# Altium schematic sheet 04_USB_diag.SchDoc: USB diagram
size A4; Organization: Lime Microsystems; Address1: Surrey Tech Centre; Address2: Guildford GU2 7YG; Address3: Surrey; Address4: United Kingdom; Revision: v1.3; SheetNumber: 4; SheetTotal: 13
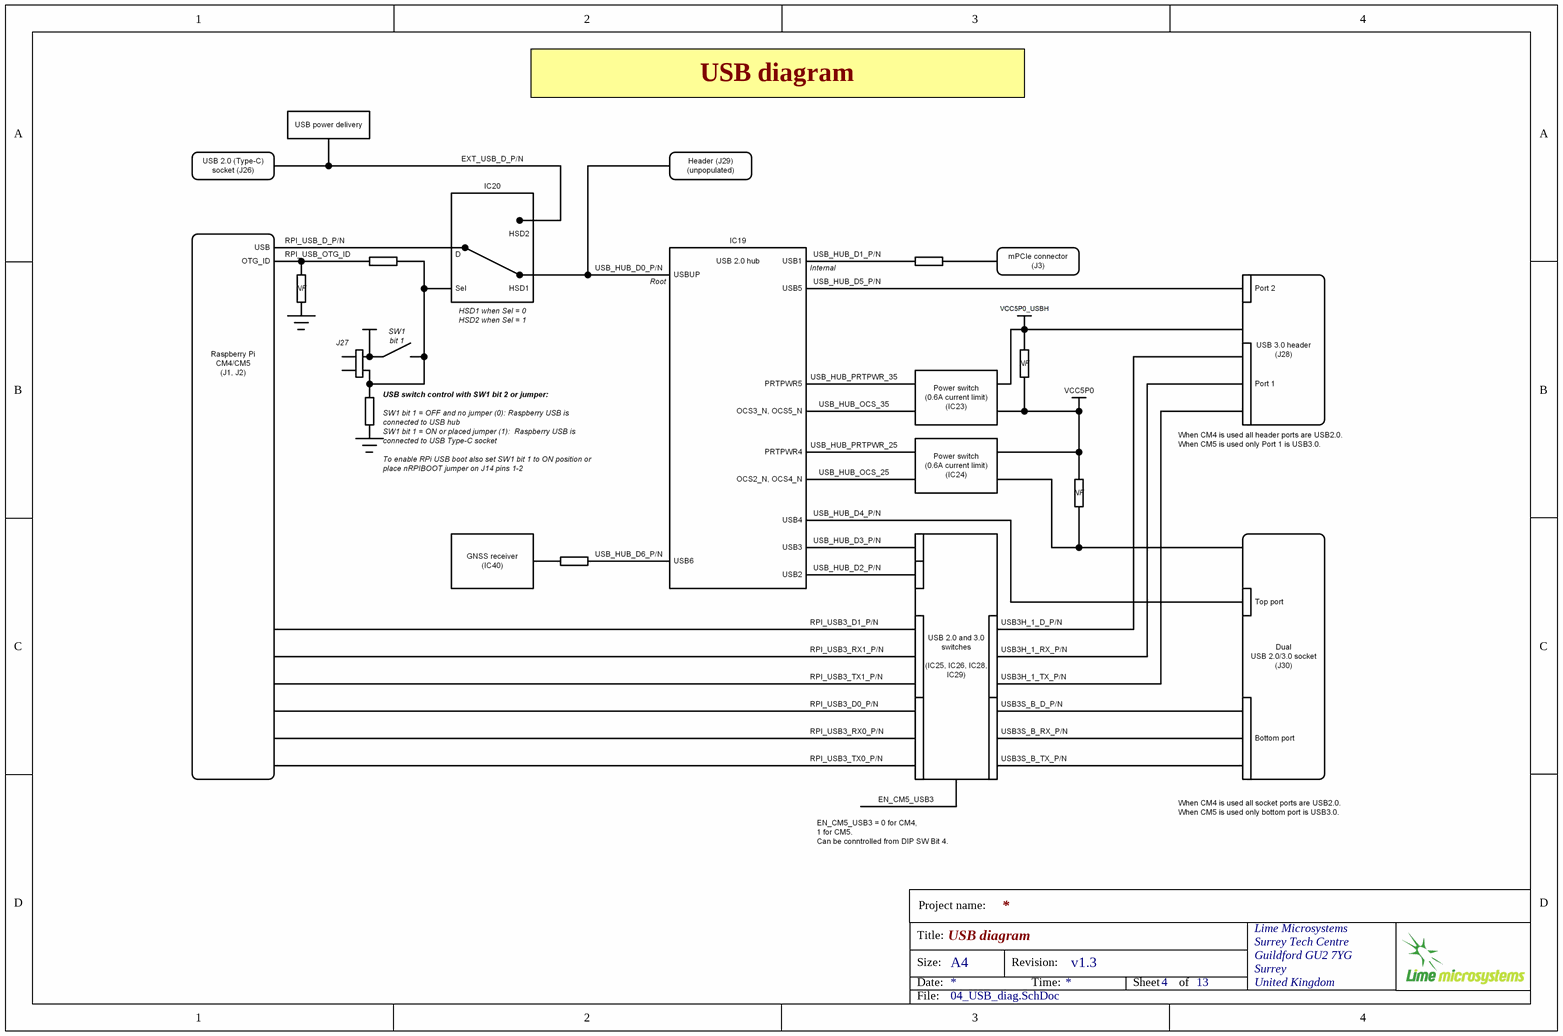
[diagram p0: 04_USB_diag.SchDoc]

## Notes on the sheet
- USB diagram
- Project name:
- Title:
- Size:
- Date:
- A4
- Revision:
- Time:
- Sheet
- of
- File: